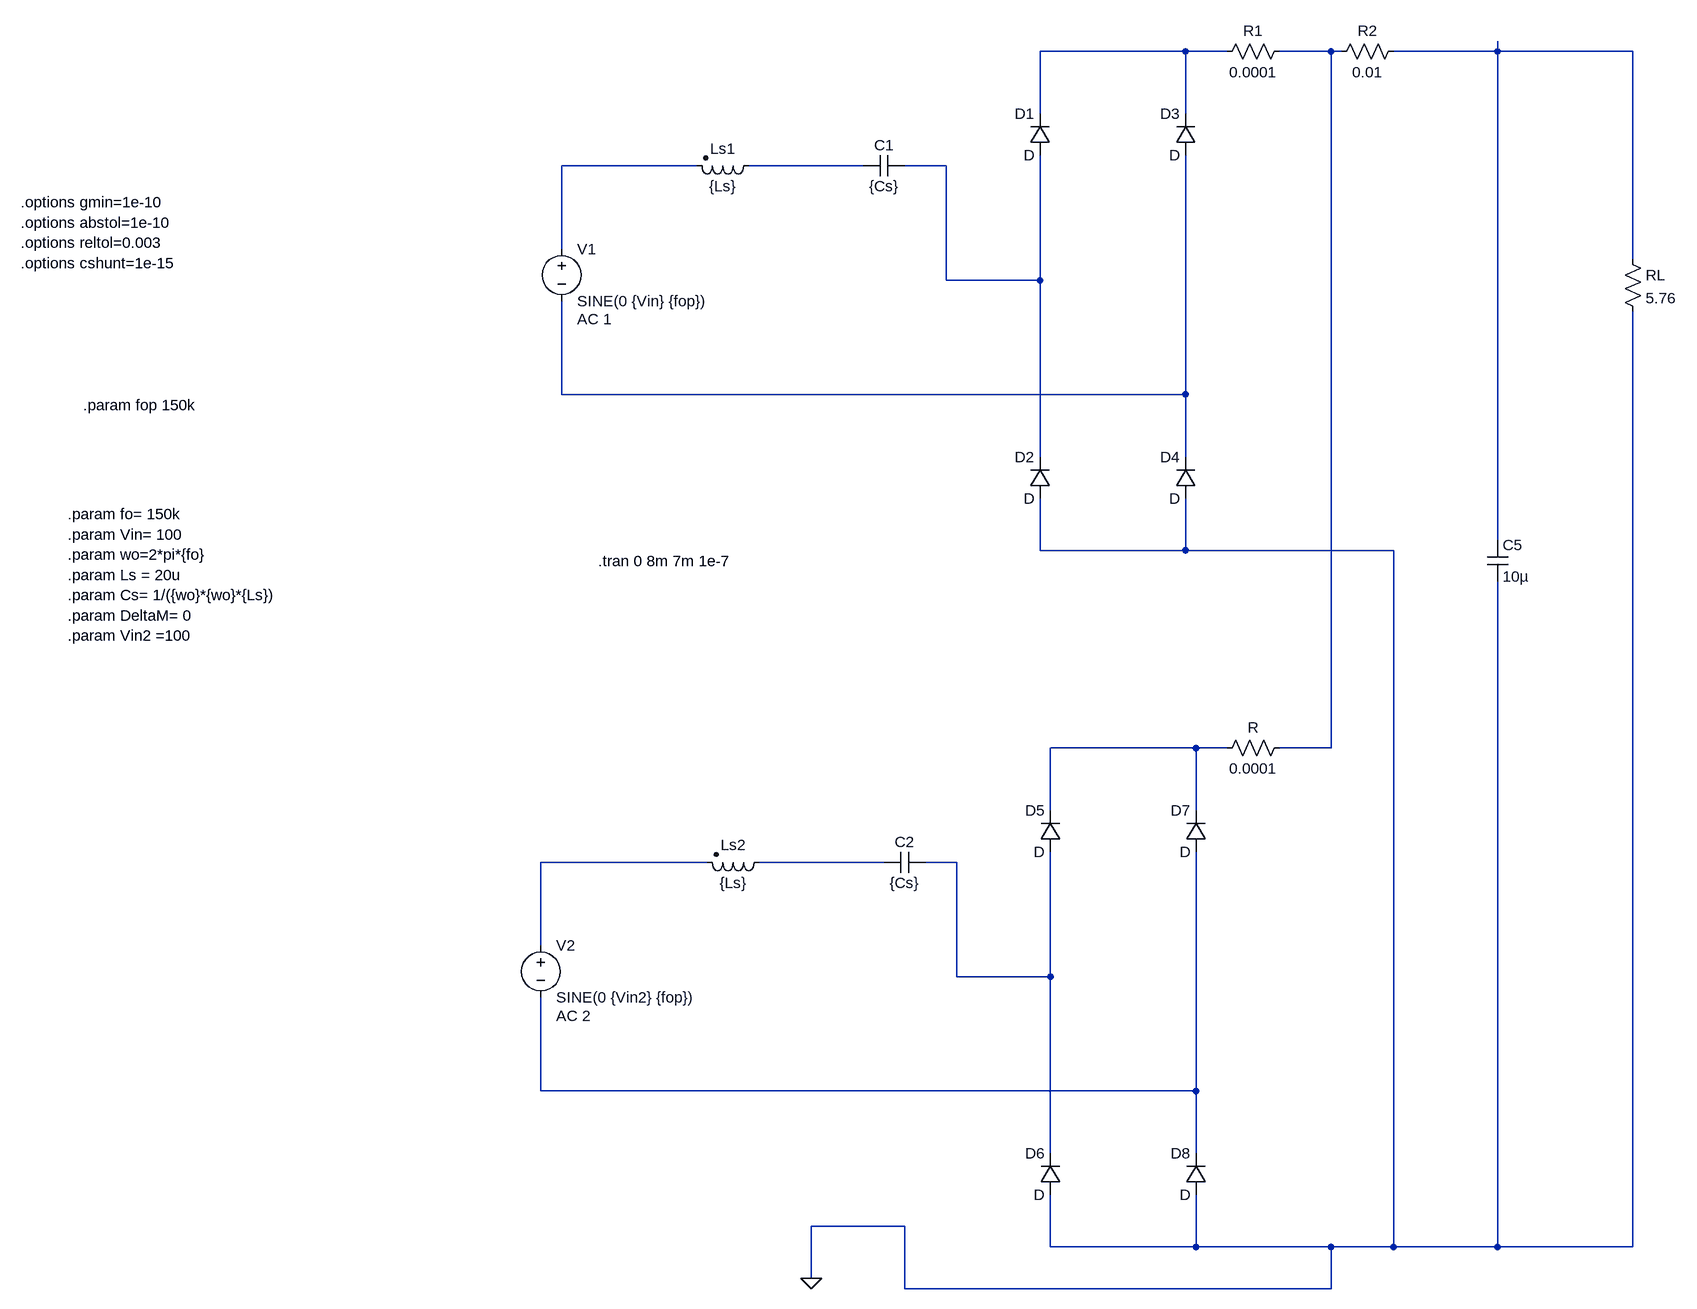
[diagram p0: schematic series-parallel.asc]
series-parallel.asc, the LTspice schematic file:
Version 4
SHEET 1 2752 1872
WIRE 1936 -240 1712 -240
WIRE 2000 -240 1936 -240
WIRE 2160 -240 2080 -240
WIRE 2176 -240 2160 -240
WIRE 2416 -240 2416 -256
WIRE 2416 -240 2256 -240
WIRE 2624 -240 2416 -240
WIRE 1712 -144 1712 -240
WIRE 1936 -144 1936 -240
WIRE 1184 -64 976 -64
WIRE 1440 -64 1264 -64
WIRE 1568 -64 1504 -64
WIRE 976 64 976 -64
WIRE 2624 80 2624 -240
WIRE 1568 112 1568 -64
WIRE 1712 112 1712 -80
WIRE 1712 112 1568 112
WIRE 976 288 976 144
WIRE 1936 288 1936 -80
WIRE 1936 288 976 288
WIRE 1712 384 1712 112
WIRE 1936 384 1936 288
WIRE 2416 512 2416 -240
WIRE 1712 528 1712 448
WIRE 1936 528 1936 448
WIRE 1936 528 1712 528
WIRE 2256 528 1936 528
WIRE 1952 832 1728 832
WIRE 2000 832 1952 832
WIRE 2160 832 2160 -240
WIRE 2160 832 2080 832
WIRE 1728 928 1728 832
WIRE 1952 928 1952 832
WIRE 1200 1008 944 1008
WIRE 1472 1008 1280 1008
WIRE 1584 1008 1536 1008
WIRE 944 1136 944 1008
WIRE 1584 1184 1584 1008
WIRE 1728 1184 1728 992
WIRE 1728 1184 1584 1184
WIRE 944 1360 944 1216
WIRE 1952 1360 1952 992
WIRE 1952 1360 944 1360
WIRE 1728 1456 1728 1184
WIRE 1952 1456 1952 1360
WIRE 1504 1568 1360 1568
WIRE 1728 1600 1728 1520
WIRE 1952 1600 1952 1520
WIRE 1952 1600 1728 1600
WIRE 2160 1600 1952 1600
WIRE 2256 1600 2256 528
WIRE 2256 1600 2160 1600
WIRE 2416 1600 2416 576
WIRE 2416 1600 2256 1600
WIRE 2624 1600 2624 160
WIRE 2624 1600 2416 1600
WIRE 1360 1648 1360 1568
WIRE 1504 1664 1504 1568
WIRE 2160 1664 2160 1600
WIRE 2160 1664 1504 1664
FLAG 1360 1648 0
SYMBOL voltage 976 48 R0
WINDOW 123 24 124 Left 2
WINDOW 39 0 0 Left 0
SYMATTR Value2 AC 1
SYMATTR InstName V1
SYMATTR Value SINE(0 {Vin} {fop})
SYMBOL ind2 1280 -80 R90
WINDOW 0 5 56 VBottom 2
WINDOW 3 32 56 VTop 2
SYMATTR InstName Ls1
SYMATTR Value {Ls}
SYMATTR Type ind
SYMBOL cap 1504 -80 R90
WINDOW 0 0 32 VBottom 2
WINDOW 3 32 32 VTop 2
SYMATTR InstName C1
SYMATTR Value {Cs}
SYMBOL diode 1728 -80 R180
WINDOW 0 24 64 Left 2
WINDOW 3 24 0 Left 2
SYMATTR InstName D1
SYMBOL diode 1728 448 R180
WINDOW 0 24 64 Left 2
WINDOW 3 24 0 Left 2
SYMATTR InstName D2
SYMBOL diode 1952 -80 R180
WINDOW 0 24 64 Left 2
WINDOW 3 24 0 Left 2
SYMATTR InstName D3
SYMBOL diode 1952 448 R180
WINDOW 0 24 64 Left 2
WINDOW 3 24 0 Left 2
SYMATTR InstName D4
SYMBOL res 2608 64 R0
SYMATTR InstName RL
SYMATTR Value 5.76
SYMBOL ind2 1296 992 R90
WINDOW 0 5 56 VBottom 2
WINDOW 3 32 56 VTop 2
SYMATTR InstName Ls2
SYMATTR Value {Ls}
SYMATTR Type ind
SYMBOL cap 1536 992 R90
WINDOW 0 0 32 VBottom 2
WINDOW 3 32 32 VTop 2
SYMATTR InstName C2
SYMATTR Value {Cs}
SYMBOL diode 1744 992 R180
WINDOW 0 24 64 Left 2
WINDOW 3 24 0 Left 2
SYMATTR InstName D5
SYMBOL diode 1744 1520 R180
WINDOW 0 24 64 Left 2
WINDOW 3 24 0 Left 2
SYMATTR InstName D6
SYMBOL diode 1968 992 R180
WINDOW 0 24 64 Left 2
WINDOW 3 24 0 Left 2
SYMATTR InstName D7
SYMBOL diode 1968 1520 R180
WINDOW 0 24 64 Left 2
WINDOW 3 24 0 Left 2
SYMATTR InstName D8
SYMBOL res 2272 -256 R90
WINDOW 0 0 56 VBottom 2
WINDOW 3 32 56 VTop 2
SYMATTR InstName R2
SYMATTR Value 0.01
SYMBOL voltage 944 1120 R0
WINDOW 123 24 124 Left 2
WINDOW 39 0 0 Left 0
SYMATTR Value2 AC 2
SYMATTR InstName V2
SYMATTR Value SINE(0 {Vin2} {fop})
SYMBOL cap 2400 512 R0
SYMATTR InstName C5
SYMATTR Value 10µ
SYMBOL res 2096 -256 R90
WINDOW 0 0 56 VBottom 2
WINDOW 3 32 56 VTop 2
SYMATTR InstName R1
SYMATTR Value 0.0001
SYMBOL res 2096 816 R90
WINDOW 0 0 56 VBottom 2
WINDOW 3 32 56 VTop 2
SYMATTR InstName R
SYMATTR Value 0.0001
TEXT 1032 544 Left 2 !.tran 0 8m 7m 1e-7
TEXT 240 304 Left 2 !.param fop 150k
TEXT 216 472 Left 2 !.param fo= 150k\n.param Vin= 100\n.param wo=2*pi*{fo}\n.param Ls = 20u\n.param Cs= 1/({wo}*{wo}*{Ls})\n.param DeltaM= 0\n.param Vin2 =100
TEXT 144 -8 Left 2 !.options gmin=1e-10\n.options abstol=1e-10\n.options reltol=0.003\n.options cshunt=1e-15

The netlist it stands for:
* series-parallel.asc
V1 N004 N007 SINE(0 {Vin} {fop}) AC 1
Ls1 N005 N004 {Ls}
C1 N006 N005 {Cs}
D1 N006 N001 D
D2 0 N006 D
D3 N007 N001 D
D4 0 N007 D
RL N003 0 5.76
Ls2 N010 N009 {Ls}
C2 N011 N010 {Cs}
D5 N011 N008 D
D6 0 N011 D
D7 N012 N008 D
D8 0 N012 D
R2 N003 N002 0.01
V2 N009 N012 SINE(0 {Vin2} {fop}) AC 2
C5 N003 0 10µ
R1 N002 N001 0.0001
R N002 N008 0.0001
.model D D
.lib standard.dio
.tran 0 8m 7m 1e-7
.param fop 150k
.param fo= 150k
.param Vin= 100
.param wo=2*pi*{fo}
.param Ls = 20u
.param Cs= 1/({wo}*{wo}*{Ls})
.param DeltaM= 0
.param Vin2 =100
.options gmin=1e-10
.options abstol=1e-10
.options reltol=0.003
.options cshunt=1e-15
.backanno
.end